# EasyEDA Pro project G3106.eprj

# Schematic G3106
Board Name: G3106; Create Date: 2025-10-19; Page Name: xo-40; Project Name: XO-40; Schematic Name: G3106; Update Date: 2025-10-19; Company: 嘉立创EDA; Page Size: A4; Version: V1.0
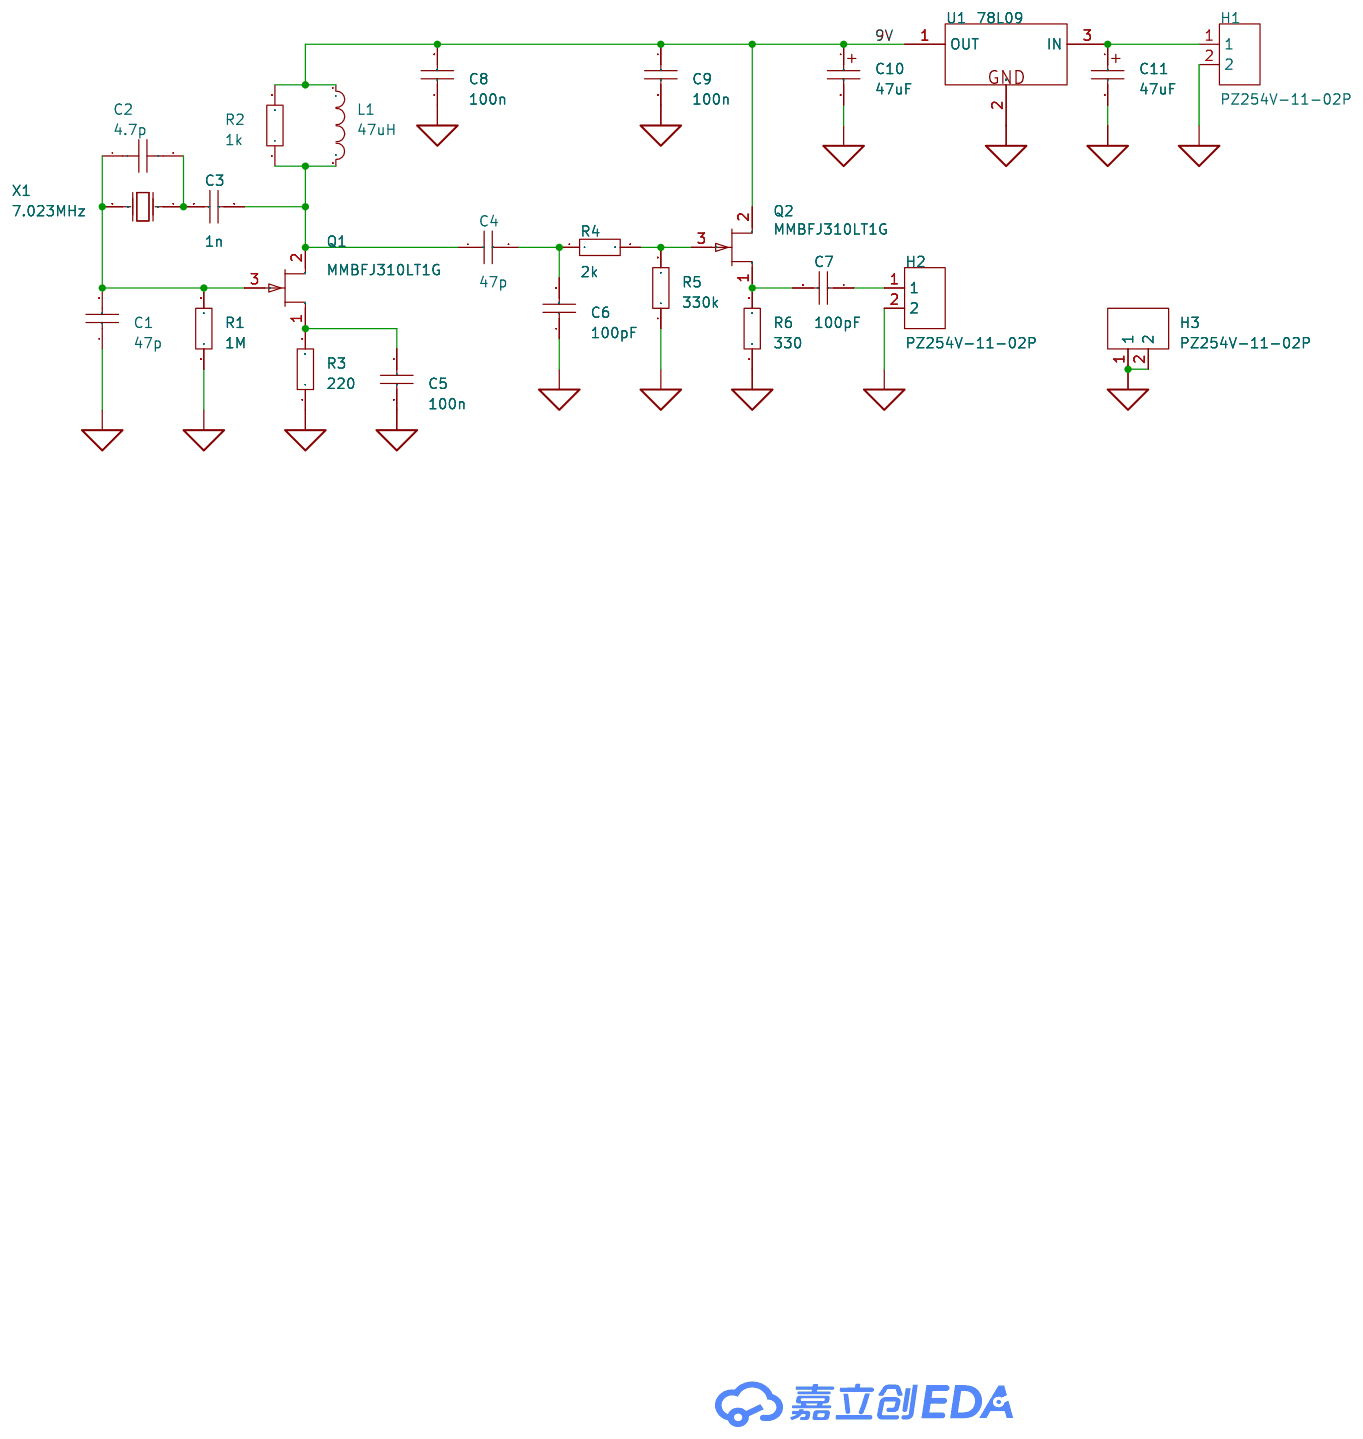
[diagram p0: schematic sheet]

## Parts
C1  47p  [C0603]
C2  4.7p  [C0603]
C3  1n  [C0603]
C4  47p  [C0603]
C5  100n  [C0603]
C6  100pF  [C0603]
C7  100pF  [C0603]
C8  100n  [C0603]
C9  100n  [C0603]
C10  47uF  [CASE-B_3528]
C11  47uF  [CASE-B_3528]
H1  PZ254V-11-02P  [HDR-TH_2P-P2.54-V-M]
H2  PZ254V-11-02P  [HDR-TH_2P-P2.54-V-M]
H3  PZ254V-11-02P  [HDR-TH_2P-P2.54-V-M]
L1  47uH  [L1210]
Q1  MMBFJ310LT1G  [SOT-23-3_L2.9-W1.6-P1.90-LS2.8-BR]
Q2  MMBFJ310LT1G  [SOT-23-3_L2.9-W1.6-P1.90-LS2.8-BR]
R1  1M  [R0603]
R2  1k  [R0603]
R3  220  [R0603]
R4  2k  [R0603]
R5  330k  [R0603]
R6  330  [R0603]
U1  78L09  [SOT-89-3_L4.5-W2.5-P1.50-LS4.2-BR]
X1  7.023MHz  [OSC-TH_L10.0-W4.5-P5.00]

## Library data of the parts
C1 C3-C9 = CL10C101JB8NNNC: LCSC Part Name: 100pF ±5% 50V; Supplier Part: C14858; Manufacturer: SAMSUNG(三星); Supplier Footprint: 0603; JLCPCB Part Class: 基础库; Datasheet: https://item.szlcsc.com/datasheet/CL10C101JB8NNNC/15530.html; Supplier: LCSC; Tolerance: ±5%; Voltage Rating: 50V; Temperature Coefficient: C0G
C2 = CAP_0603: Supplier Footprint: 0603
C10 C11 = TAJB476K010RNJ: LCSC Part Name: 47uF ±10% 10V; Supplier Part: C22036; Manufacturer: Kyocera AVX; Supplier Footprint: CASE-B-3528; JLCPCB Part Class: 扩展库; Datasheet: https://atta.szlcsc.com/upload/public/pdf/source/20160107/1457707750344.pdf; Supplier: LCSC; Tolerance: ±10%; Rated Voltage: 10V; Equivalent Series Resistance(ESR): 1Ω@100kHz; Operating Temperature: -55℃~+125℃
H1-H3 = PZ254V-11-02P: LCSC Part Name: 1x2P 间距:2.54mm 方针 直插; Supplier Part: C492401; Manufacturer: XFCN(兴飞); Supplier Footprint: 插件,P=2.54mm; JLCPCB Part Class: 扩展库; Datasheet: https://item.szlcsc.com/datasheet/PZ254V-11-02P/502957.html; Supplier: LCSC; Pin Structure: 1x2P; Pitch: 2.54mm; Circluar Pins/Square Pins: 方针; Mounting Type: 直插; Number of Rows: 单排; Number of Pins: 2P; Length of Mating Pin: 6mm; Insulation Height: 2.5mm; Length of End Connection Pin: 3mm; Contact Material: 黄铜; Operating Temperature: -40℃~+105℃; Color: 黑色
L1 = NLV32T-220J-PF: LCSC Part Name: 22uH ±5%; Supplier Part: C76838; Manufacturer: TDK; Supplier Footprint: 1210; JLCPCB Part Class: 扩展库; Datasheet: https://item.szlcsc.com/datasheet/NLV32T-220J-PF/77965.html; Supplier: LCSC; Tolerance: ±5%; Current Rating: 110mA; DC Resistance(DCR): 3.7Ω
Q1 Q2 = MMBFJ310LT1G: Supplier Part: C33416; Manufacturer: onsemi(安森美); Supplier Footprint: SOT-23; JLCPCB Part Class: 扩展库; Datasheet: https://item.szlcsc.com/datasheet/MMBFJ310LT1G/34381.html; Supplier: LCSC
R1 R3 R5 R6 = 0603WAF1002T5E: LCSC Part Name: 厚膜电阻 10kΩ ±1% 100mW; Supplier Part: C25804; Manufacturer: UNI-ROYAL(厚声); Supplier Footprint: 0603; JLCPCB Part Class: 基础库; Datasheet: https://item.szlcsc.com/datasheet/0603WAF1002T5E/26547.html; Supplier: LCSC; Type: 厚膜电阻; Tolerance: ±1%; Power(Watts): 100mW; Voltage-Supply(Max): 75V; Temperature Coefficient: ±100ppm/℃; Operating Temperature: -55℃~+155℃
R2 R4 = Res_0603: Supplier Footprint: 0603
U1 = 78L09_C5246135: LCSC Part Name: 三端正电压稳压器; Supplier Part: C5246135; Manufacturer: TWGMC(迪嘉); Supplier Footprint: SOT-89; JLCPCB Part Class: 扩展库; Datasheet: https://item.szlcsc.com/datasheet/78L09/5955908.html; Supplier: LCSC; Output Type: 固定; Voltage - Supply: 24V; Output Voltage: 9V; Output Current: 40mA; Power Supply Rejection Ratio (PSRR): 38dB@(120Hz); Voltage Dropout: 1.7V; standby current: 6mA; Noise: 70uV; Operating Temperature: -20℃~+120℃@(Tj); Output Configuration: 正极; Number of Outputs: 1
X1 = X49SD8MSD2SC: LCSC Part Name: HC-49US 8MHZ 2P 49S 20PF ±20PPM -20~70℃ (±30PPM); Supplier Part: C21263; Manufacturer: YXC(扬兴晶振); Supplier Footprint: HC-49S; JLCPCB Part Class: 扩展库; Datasheet: https://item.szlcsc.com/datasheet/X49SD8MSD2SC/21980.html; Supplier: LCSC; Type: 直插晶振; Normal temperature Frequency Tolerance: ±20ppm; Load Capacitance: 20pF; Frequency Stability: ±30ppm; Operating Temperature: -20℃~+70℃

## Nets
9V: C8.2 C9.1 C10.1 L1.1 Q2.2(S) R2.2 U1.1(OUT)
AGND: C1.1 C5.2 C6.1 C8.1 C9.2 C10.2 C11.2 H1.2 H2.2 H3.1 H3.2 R1.1 R3.1 R5.1 R6.1 U1.2(GND)
$1N204: C5.1 Q1.1(D) R3.2
$1N974: C2.2 C3.2 X1.1(OSC1)
$1N1135: C4.2 C6.2 R4.1
$1N1161: C7.2 Q2.1(D) R6.2
$1N1163: C11.1 H1.1 U1.3(IN)
$1N1300: C1.2 C2.1 Q1.3(G) R1.2 X1.2(OSC2)
$1N1309: C3.1 C4.1 L1.2 Q1.2(S) R2.1
$1N1472: Q2.3(G) R4.2 R5.2
$1N1802: C7.1 H2.1

# Board G3106
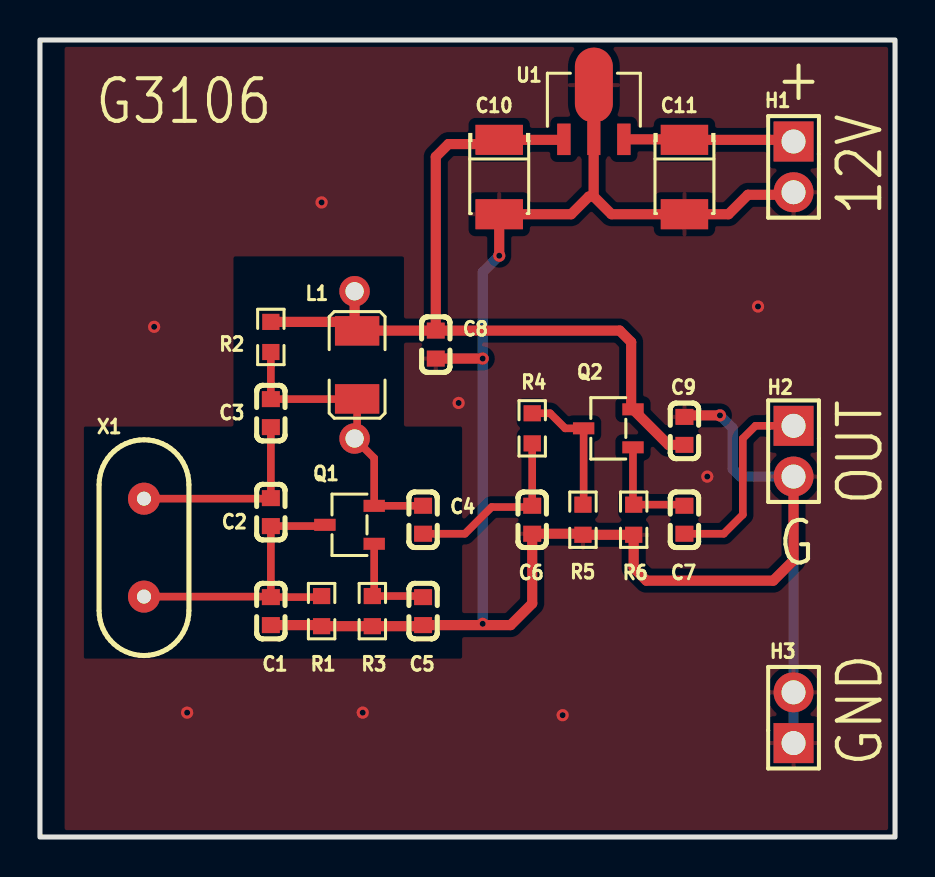
[diagram p1: board, top side]
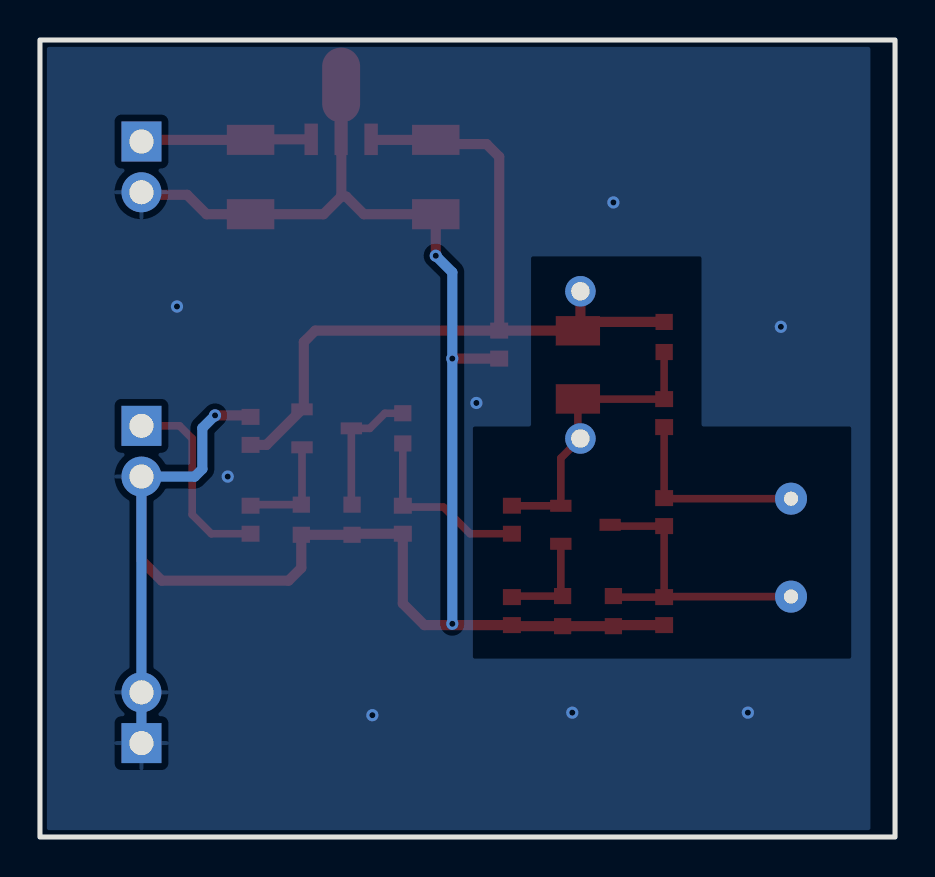
[diagram p2: board, bottom side, seen from below]

Outline 42.8 x 39.88 mm; copper layers: Top Layer, Bottom Layer. Coordinates in mm from the lower left corner of the outline.
Outline path: rectangle 0,39.88 42.8,0
Stack: Top Layer 0.035mm / Dielectric1 1.51mm FR4 er 4.5 / Bottom Layer 0.035mm

## Design rules (mm)
template: 自定义配置
spacing copperThickness1oz (default): track to track 0.102, other pairs 0.152 to 0.3
spacing copperThickness2oz: track to track 0.203, other pairs 0.152 to 0.3
track width copperThickness1oz (default): min 0.127, default 0.381, max 2.54
track width copperThickness2oz: min 0.203, default 0.254, max 2.54
differential pair differentialPair (default): width min 0.127, default 0.254, max 2.54; gap min 0.152, default 0.152
via viaSize (default): diameter min 0.5, default 0.61, max 10; hole min 0.3, default 0.305, max 6.3
pour e239 uses copperRegion

## Placement (name value [footprint] x y rotation side)
C1  47p  [C0603]  11.56 11.3 90 top
C2  4.7p  [C0603]  11.56 16.26 90 top
C3  1n  [C0603]  11.56 21.21 270 top
C4  47p  [C0603]  19.18 15.88 270 top
C5  100n  [C0603]  19.18 11.3 270 top
C6  100pF  [C0603]  24.64 15.88 90 top
C7  100pF  [C0603]  32.26 15.88 90 top
C8  100n  [C0603]  19.81 24.64 90 top
C9  100n  [C0603]  32.26 20.32 90 top
C10  47uF  [CASE-B_3528]  22.99 33.02 270 top
C11  47uF  [CASE-B_3528]  32.26 33.02 270 top
H1  PZ254V-11-02P  [HDR-TH_2P-P2.54-V-M]  37.72 33.53 270 top
H2  PZ254V-11-02P  [HDR-TH_2P-P2.54-V-M]  37.72 19.3 270 top
H3  PZ254V-11-02P  [HDR-TH_2P-P2.54-V-M]  37.72 5.97 90 top
L1  47uH  [L1210]  15.88 23.62 270 top
NOREF  -  [Pad_e28]  15.75 19.94 0 top
NOREF#2  -  [Pad_e27]  15.75 27.3 0 top
NOREF#3  -  [Pad_e629]  24.64 21.24 0 top
Q1  MMBFJ310LT1G  [SOT-23-3_L2.9-W1.6-P1.90-LS2.8-BR]  15.49 15.62 0 top
Q2  MMBFJ310LT1G  [SOT-23-3_L2.9-W1.6-P1.90-LS2.8-BR]  28.45 20.45 0 top
R1  1M  [R0603]  14.1 11.3 90 top
R2  1k  [R0603]  11.56 25.02 90 top
R3  220  [R0603]  16.64 11.3 90 top
R4  2k  [R0603]  24.64 20.45 90 top
R5  330k  [R0603]  27.18 15.88 90 top
R6  330  [R0603]  29.72 15.88 90 top
U1  78L09  [SOT-89-3_L4.5-W2.5-P1.50-LS4.2-BR]  27.72 36.26 270 top
X1  7.023MHz  [OSC-TH_L10.0-W4.5-P5.00]  5.21 14.48 0 top

## Footprints (pads in the part's own frame, mm; a bottom-side part is the same pattern mirrored in y, then rotated)
C0603
  rect 0.8x0.9 smd: 1(-0.7,0) 2(0.7,0)
CASE-B_3528
  rect 1.506x2.376 smd: 1(-1.861,0) 2(1.861,0)
HDR-TH_2P-P2.54-V-M
  rect 2x2 hole 1.2: 1(-1.27,0)
  round 2 hole 1.2: 2(1.27,0)
L1210
  rect 1.474x2.22 smd: 1(-1.703,0) 2(1.703,0)
OSC-TH_L10.0-W4.5-P5.00
  round 1.6 hole 0.7: 1(0,2.45) 2(0,-2.45)
Pad_e27
  round 1.524 hole 0.914: 1(0,0)
Pad_e28
  round 1.524 hole 0.914: 2(0,0)
Pad_e629
  round 0.61 smd: TP1(0,0)
R0603
  rect 0.806x0.864 smd: 1(-0.753,0) 2(0.753,0)
SOT-23-3_L2.9-W1.6-P1.90-LS2.8-BR
  rect 1.07x0.6 smd: 1(1.235,-0.95) 2(1.235,0.95) 3(-1.235,0)
SOT-89-3_L4.5-W2.5-P1.50-LS4.2-BR
  rect 1.575x0.672 smd: 1(1.356,-1.5) 3(1.356,1.5)
  custom 5.377x1.9 smd: 2(-1.356,0)

## Nets
9V: C8.2 C9.1 C10.1 L1.1 NOREF#2.1 Q2.2 R2.2 U1.1
AGND: C1.1 C5.2 C6.1 C8.1 C9.2 C10.2 C11.2 H1.2 H2.2 H3.1 H3.2 R1.1 R3.1 R5.1 R6.1 U1.2
$1N204: C5.1 Q1.1 R3.2
$1N974: C2.2 C3.2 X1.1
$1N1135: C4.2 C6.2 R4.1
$1N1161: C7.2 Q2.1 R6.2
$1N1163: C11.1 H1.1 U1.3
$1N1300: C1.2 C2.1 Q1.3 R1.2 X1.2
$1N1309: C3.1 C4.1 L1.2 NOREF.2 Q1.2 R2.1
$1N1472: NOREF#3.TP1 Q2.3 R4.2 R5.2
$1N1802: C7.1 H2.1

## Via types
v1: diameter 0.61, hole 0.305, Top Layer to Bottom Layer, 12 vias

## Routing (per net, layer and track width the routed paths; a pad name or vN(x,y) marks a point on that pad's centre or on a via; arc(x,y) is an arc through that point)
9V: length 42.3
  Top Layer w0.508: R2.2 15.43,25.77 15.75,25.45 NOREF#2.1 ; C8.2 15.89,25.34 L1.1 ; C8.2 29.02,25.34 29.59,24.77 29.59,21.49 Q2.2 31.46,19.62 C9.1 ; C8.2 19.81,34.04 20.45,34.67 22.78,34.67 C10.1 26.2,34.88 U1.1
AGND: length 102.7
  Top Layer w0.508: v1(22.99,29.08) C10.2 26.59,31.16 27.47,32.04 27.72,32.04 28.61,31.16 C11.2 34.46,31.16 35.43,32.13 37.59,32.13 H1.2 ; 27.72,37.62 27.72,37.61 27.72,32.05 ; v1(34.04,21.09) 32.33,21.09 C9.2 ; C1.1 14.04,10.6 R1.1 R3.1 19.12,10.55 C5.2 23.56,10.6 24.64,11.68 C6.1 27.12,15.17 R5.1 R6.1 29.72,13.46 30.35,12.83 36.7,12.83 37.72,13.84 37.72,18.03 ; C8.1 v1(22.16,23.94)
  Bottom Layer w0.508: v1(22.99,29.08) 22.16,28.26 v1(22.16,23.94) v1(22.16,10.67) ; H3.1 H3.2 37.72,18.03 35.05,18.03 34.67,18.41 34.67,20.46 v1(34.04,21.09)
  vias: v1(5.72,25.53) v1(7.37,6.22) v1(14.1,31.75) v1(16.16,6.22) v1(20.96,21.72) v1(26.16,6.1) v1(33.4,18.03) v1(35.94,26.54)
$1N204: length 5.2
  Top Layer w0.381: Q1.1 16.73,12.15 R3.2 19.12,12.06 C5.1
$1N974: length 9.9
  Top Layer w0.381: C3.2 C2.2 11.53,16.93 X1.1
$1N1135: length 9.2
  Top Layer w0.381: R4.1 C6.2 24.57,16.51 22.61,16.51 21.27,15.17 C4.2
$1N1161: length 5.4
  Top Layer w0.381: C7.2 32.2,16.63 R6.2 29.68,16.66 Q2.1
$1N1163: length 8.5
  Top Layer w0.508: H1.1 37.64,34.88 C11.1 32.23,34.91 U1.3
$1N1300: length 15.2
  Top Layer w0.381: X1.2 11.53,12.03 C1.2 ; C1.2 14.04,12 R1.2 ; C1.2 C2.1 14.19,15.56 Q1.3
$1N1309: length 14.9
  Top Layer w0.381: C4.1 19.17,16.57 Q1.2 16.73,18.96 NOREF.2 15.88,20.07 L1.2 15.87,21.91 C3.1 R2.1
$1N1472: length 6.7
  Top Layer w0.381: R5.2 27.21,16.66 Q2.3 26.29,20.45 25.54,21.2 R4.2
$1N1802: length 9.9
  Top Layer w0.381: C7.1 34.22,15.17 35.18,16.13 35.18,19.94 35.81,20.57 H2.1

## Copper pours and planes (outline as drawn; the poured copper is in the pictures)
AGND on Top Layer: 1.14,39.88 42.8,39.88 42.8,0 1.14,0
AGND on Bottom Layer: 1.14,39.88 42.8,39.88 42.8,0 1.14,0

## Text on the board
Top Silkscreen Layer: G3106 | + | G | 12V | OUT | GND
